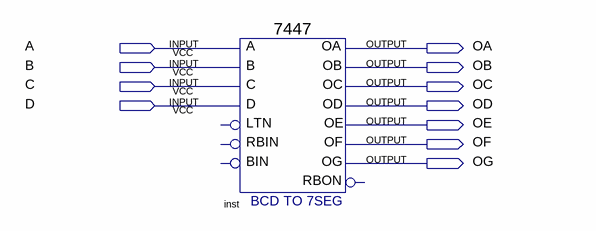
[diagram p0: schematic sheet]
// Quartus schematic programthefpga.bdf as structural Verilog: 1 symbols, 11 pins
module programthefpga (
  input  A,
  input  B,
  input  C,
  input  D,
  output OA,
  output OB,
  output OC,
  output OD,
  output OE,
  output OF,
  output OG
);

  \7447  inst (
    .B(B), .C(C), .D(D), .A(A), .OB(OB), .OC(OC), .OE(OE), .OD(OD), .OF(OF), .OG(OG), .OA(OA));  // open: LTN, RBIN, BIN, RBON
endmodule
